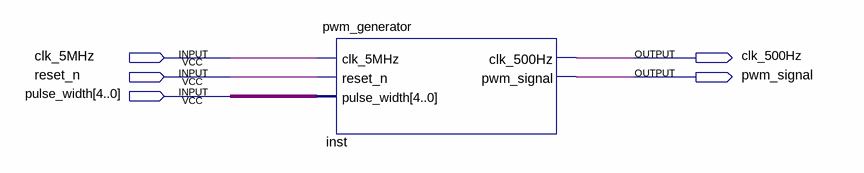
[diagram p0: schematic sheet]
// Quartus schematic pwm.bdf as structural Verilog: 1 symbols, 5 pins
module pwm (
  input  clk_5MHz,
  input  reset_n,
  input  [4:0] pulse_width,
  output clk_500Hz,
  output pwm_signal
);

  pwm_generator inst (
    .clk_5MHz(clk_5MHz), .reset_n(reset_n), .pulse_width(pulse_width), .clk_500Hz(clk_500Hz),
    .pwm_signal(pwm_signal));
endmodule
